# Altium schematic sheet Power_Input.SchDoc: Power Input
size OrCAD A; DocumentNumber: LM-008; Revision: B; SheetNumber: 1; SheetTotal: 2; DocumentName: LM-008
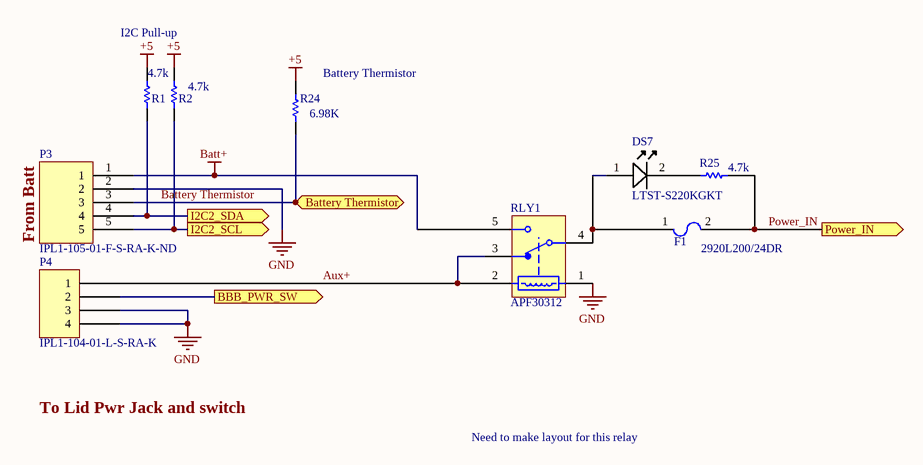
[diagram p0: Power_Input.SchDoc]

## Parts
DS7  Manufacturer Part Number: LTST-S220KGKT  [0805C_L]  (hidden comment: Lite-On LTST-S220KGKT Green LED, 571 nm 2012 (0805) Side View, Rectangle Lens SMD package)
F1  PCT  [CAPC7451X12N]  (value not drawn)
P3  Supplier Part Number 1: IPL1-105-01-F-S-RA-K-ND  [IPL1-105-01-F-S-RA]  (hidden comment: IPL1-105-01-F-S-RA)
P4  IPL1-104-01-L-S-RA-K  [IPL1-104-01-L-S-RA-K]
R1  Resistance (Ohms): 4.7k  [RESC0805(2012)_N]  (hidden comment: 3K74 0.125W 1% 0805 (2012 Metric)  SMD)
R2  Resistance (Ohms): 4.7k  [RESC0805(2012)_N]  (hidden comment: 3K74 0.125W 1% 0805 (2012 Metric)  SMD)
R24  6.98K  [RESC0402(1005)_L]
R25  Resistance (Ohms): 4.7k  [RESC0805(2012)_M]  (hidden comment: RES SMD 4.7K OHM 1% 1/8W 0805)
RLY1  APF30312  [PNSC-PF-5-2800x500x1500_V]

## Ports
Battery Thermistor (out), BBB_PWR_SW (out), I2C2_SCL (out), I2C2_SDA (out), Power_IN (out)

## Nets
+5: R1.2 R2.2 R24.2
Batt+: P3.1 RLY1.5(NO)
GND: P3.2 P4.3 P4.4 RLY1.1
Aux+: P4.1 RLY1.2 RLY1.3(NC)
Battery Thermistor: P3.3 R24.1 ; port Battery Thermistor
BBB_PWR_SW: P4.2 ; port BBB_PWR_SW
I2C2_SCL: P3.5 R2.1 ; port I2C2_SCL
I2C2_SDA: P3.4 R1.1 ; port I2C2_SDA
Power_IN: F1.2 R25.1 ; port Power_IN
NetDS7_1: DS7.1(A) F1.1 RLY1.4(COM)
NetDS7_2: DS7.2(K) R25.2

## Notes on the sheet
- I2C Pull-up
- (near R24) Battery Thermistor
- From Batt
- (near F1) 2920L200/24DR
- To Lid Pwr Jack and switch
- Need to make layout for this relay
- Title
- Size:
- Date:
- Orcad A
- Number:
- Time:
- Revision:
- Sheet
- of
- ZLS Corporation
- 7801 North Lamar Blvd.
- Suite E-184
- Austin, Texas 78752  USA
- (512) 453-0288
- File:

## Library data of the parts
DS7 = LED A/K: Manufacturer: Vishay / Lite-On; Lens Colour: Colorless; Viewing Angle: 130°; Luminous Intensity: 35mcd; Forward Current: 20mA; Forward Voltage: 2V; Lens Style: Diffused,Colorless; Power Rating: 75mW; Dominant Wavelength: 568nm; Lens Transparency: Clear; Number of Elements: 1; Power Dissipation: 75W; Wavelength: 574nm; Supplier 1: Digi-Key; Supplier Part Number 1: 160-1468-1-ND; Stock 1: 74800; Pricing 1: 1=0.29, 10=0.212, 25=0.1564, 100=0.1117, 250=0.0759, 500=0.067, 1000=0.0525 (USD); Mount: Surface Mount; Case/Package: 0805; Number of Pins: 2; Colour: Green; Case Code (Metric): 2012; Case Code (Imperial): 0805; Min Operating Temperature: -55°C; Max Operating Temperature: 85°C; Packaging: Tape and Reel; Package Quantity: 4000; Illumination Colour: Green; Test Current: 20mA; Number of LEDs: 1; Length: 2.1mm; Height: 0.6mm; Width: 1mm; Depth: 0.6mm; Radiation Hardening: No; Lead Free: Lead Free; ComponentLink1URL: https://datasheet.ciiva.com/11775/0900766b80dc0b70-11775441.pdf; ComponentLink1Description: https://datasheet.ciiva.com/11775/0900766b80dc0b70-11775441.pdf; ComponentLink2URL: https://datasheet.ciiva.com/2110/s-110-ltst-s220kgkt-2110069.pdf; ComponentLink2Description: https://datasheet.ciiva.com/2110/s-110-ltst-s220kgkt-2110069.pdf; ComponentLink3URL: https://datasheet.ciiva.com/2110/s-110-ltst-s220kgkt-2110070.pdf; ComponentLink3Description: https://datasheet.ciiva.com/2110/s-110-ltst-s220kgkt-2110070.pdf; ComponentLink4URL: https://datasheet.ciiva.com/12400/100-ltst-s220kgkt-59602-12400886.pdf; ComponentLink4Description: https://datasheet.ciiva.com/12400/100-ltst-s220kgkt-59602-12400886.pdf; ComponentLink5URL: https://datasheet.ciiva.com/2110/s-110-ltst-s220kgkt-2110071.pdf; ComponentLink5Description: https://datasheet.ciiva.com/2110/s-110-ltst-s220kgkt-2110071.pdf; ComponentLink6URL: https://datasheet.ciiva.com/16379/ltst-s220kgkt-16379082.pdf; ComponentLink6Description: https://datasheet.ciiva.com/16379/ltst-s220kgkt-16379082.pdf; Supplier 2: Farnell; Supplier Part Number 2: 2062310; RoHS: YES; Stock 2: 2271; Pricing 2: 1=0.325, 10=0.317, 100=0.23, 200=0.228, 400=0.182, 900=0.147, 3000=0.114, 9000=0.107 (GBP); ComponentLink7URL: http://www.farnell.com/cad/2124774.pdf; ComponentLink7Description: http://www.farnell.com/cad/2124774.pdf; ComponentLink8URL: http://www.farnell.com/datasheets/693084.pdf; ComponentLink8Description: http://www.farnell.com/datasheets/693084.pdf
P4 = IPL1-104-01-L-S-RA-K: Manufacturer: Samtec Inc.; Connector Type: Header; Pitch - Mating: 0.100" (2.54mm); Number of Positions: 4; Number of Positions Loaded: All; Style: Board to Cable/Wire; Shrouding: Shrouded - 4 Wall; Contact Length - Mating: 0.215" (5.46mm); Contact Length - Post: 0.085" (2.16mm); Material Flammability Rating: UL94 V-0; Voltage Rating: 675VAC, 954VDC; Supplier 1: Digi-Key; Supplier Part Number 1: SAM9597-ND; Manufacturer Part Number: IPL1-104-01-L-S-RA-K; RoHS: RoHS Compliant; Category: Connectors, Interconnects; Stock 1: 265; Pricing 1: 1=2.53, 10=2.424, 100=2.02, 500=1.717, 1000=1.4645, 5000=1.313 (USD); Packaging: Tube; Part Status: Active; Contact Type: Male Pin; Number of Rows: 1; Row Spacing - Mating: -; Mounting Type: Through Hole, Right Angle; Termination: Solder; Fastening Type: Locking Ramp; Overall Contact Length: -; Insulation Height: 0.240" (6.10mm); Contact Shape: Square; Contact Finish - Mating: Gold; Contact Finish Thickness - Mating: 10µin (0.25µm); Contact Finish - Post: Tin; Contact Material: Phosphor Bronze; Insulation Material: Liquid Crystal Polymer (LCP); Features: -; Operating Temperature: -55°C ~ 125°C; Ingress Protection: -; Insulation Color: Natural; Current Rating: -; Mated Stacking Heights: -; Contact Finish Thickness - Post: -; Applications: -; ComponentLink1URL: http://suddendocs.samtec.com/prints/ipl1-1xx-xx-xxx-s-xx-x-xx-mkt.pdf; ComponentLink1Description: http://suddendocs.samtec.com/prints/ipl1-1xx-xx-xxx-s-xx-x-xx-mkt.pdf
R1 R2 = CMP-1013-00574-1: Manufacturer: Vishay Dale; Manufacturer Part Number: CRCW08054K70FKEA; Power (Watts): 0.125W, 1/8W; Temperature Coefficient: ±100ppm/°C; Supplier 1: Digi-Key; Supplier Part Number 1: 541-4.70KCDKR-ND; RoHS: RoHS Compliant; Category: Resistors; Stock 1: 0; Pricing 1: 1=0.1, 10=0.044, 100=0.0178, 1000=0.00802, 2500=0.00696 (USD); Packaging: Digi-Reel®; Part Status: Active; Tolerance: ±1%; Composition: Thick Film; Features: Automotive AEC-Q200; Operating Temperature: -55°C ~ 155°C; Package / Case: 0805 (2012 Metric); Supplier Device Package: 0805; Size / Dimension: 0.079" L x 0.049" W (2.00mm x 1.25mm); Height - Seated (Max): 0.020" (0.50mm); Failure Rate: -; ComponentLink1URL: http://www.vishay.com/docs/20035/dcrcwe3.pdf; ComponentLink1Description: http://www.vishay.com/docs/20035/dcrcwe3.pdf
R24 = CMP-1011-00927-1: RES SMD 6.98K OHM 1% 1/16W 0402; Manufacturer: Yageo; Manufacturer Part Number: RC0402FR-076K98L; Power (Watts): 0.063W, 1/16W; Temperature Coefficient: ±100ppm/°C; Supplier 1: Digi-Key; Supplier Part Number 1: YAG3220CT-ND; RoHS: RoHS Compliant; Category: Resistors; Stock 1: 182255; Pricing 1: 1=0.1, 10=0.014, 100=0.0055, 1000=0.00247, 2500=0.00214, 5000=0.00177 (USD); Packaging: Cut Tape (CT); Part Status: Active; Tolerance: ±1%; Composition: Thick Film; Features: Moisture Resistant; Operating Temperature: -55°C ~ 155°C; Package / Case: 0402 (1005 Metric); Supplier Device Package: 0402; Size / Dimension: 0.039" L x 0.020" W (1.00mm x 0.50mm); Height - Seated (Max): 0.016" (0.40mm); Failure Rate: -; ComponentLink1URL: http://www.yageo.com/documents/recent/PYu-RC_Group_51_RoHS_L_7.pdf; ComponentLink1Description: http://www.yageo.com/documents/recent/PYu-RC_Group_51_RoHS_L_7.pdf
R25 = CMP-1013-00017-1: Manufacturer: Vishay Dale; Manufacturer Part Number: CRCW08054K70FKEA; Power (Watts): 0.125W, 1/8W; Temperature Coefficient: ±100ppm/°C; Supplier 1: Digi-Key; Supplier Part Number 1: 541-4.70KCDKR-ND; RoHS: RoHS Compliant; Category: Resistors; Stock 1: 0; Pricing 1: 1=0.1, 10=0.044, 100=0.0178, 1000=0.00802, 2500=0.00696 (USD); Packaging: Digi-Reel®; Part Status: Active; Tolerance: ±1%; Composition: Thick Film; Features: Automotive AEC-Q200; Operating Temperature: -55°C ~ 155°C; Package / Case: 0805 (2012 Metric); Supplier Device Package: 0805; Size / Dimension: 0.079" L x 0.049" W (2.00mm x 1.25mm); Height - Seated (Max): 0.020" (0.50mm); Failure Rate: -; ComponentLink1URL: http://www.vishay.com/docs/20035/dcrcwe3.pdf; ComponentLink1Description: http://www.vishay.com/docs/20035/dcrcwe3.pdf
RLY1 = CMP-1503-00270-1: PF Relays, 12 V Coil Voltage, 170 mW Nominal Operating Power, -40 to 85 degC, 5-Pin PF, Tube, Case, RoHS; Manufacturer: Panasonic; Max Switching Voltage: 250 V AC; Nominal Operating Power: 170 mW; Electrical Life: 5x10^4 (N.O.), 3x10^4 (N.C.); Max Switching Current: 6 A; Coil Voltage: 12 V; Mechanical Life(Min.operation): 5x10^6; Pb-Free: True; ComponentLink3Description: Package Specification; ComponentLink1Description: Manufacturer URL; RoHS: True; ComponentLink3URL: http://www3.panasonic.biz/ac/e_download/control/relay/power/catalog/mech_eng_pf.pdf?f_cd=300412; PackageReference: PF-5-2800x500x1500; ComponentLink1URL: http://www3.panasonic.biz/ac/ae/index.jsp; ComponentLink2Description: Datasheet; Series: PF Relays; PartNumber: APF30312; PackageDescription: 5-Pin Through Hole Terminal Package, Body 28 x 5 mm; Packing: Tube, Case; DatasheetVersion: 201402-T; Mounting Technology: Through Hole; PackageVersion: ASCTB205E, 02/2014; ComponentLink2URL: http://www3.panasonic.biz/ac/e_download/control/relay/power/catalog/mech_eng_pf.pdf?f_cd=300412
P3 = IPL1-105-01-F-S-RA: Supplier 1: Digi-Key